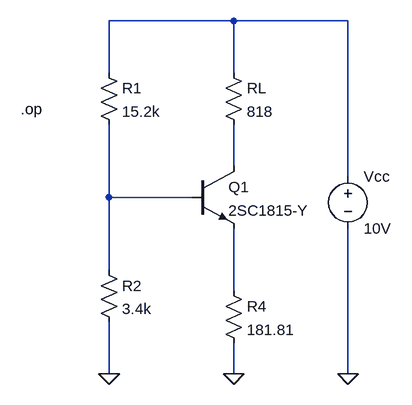
[diagram p0: schematic jikken2_denryukikan_DC.asc]
jikken2_denryukikan_DC.asc, the LTspice schematic file:
Version 4
SHEET 1 968 680
WIRE 256 -112 64 -112
WIRE 432 -112 256 -112
WIRE 64 -32 64 -112
WIRE 256 -32 256 -112
WIRE 256 112 256 48
WIRE 432 128 432 -112
WIRE 64 160 64 48
WIRE 192 160 64 160
WIRE 64 272 64 160
WIRE 256 304 256 208
WIRE 64 432 64 352
WIRE 256 432 256 384
WIRE 432 432 432 208
FLAG 64 432 0
FLAG 256 432 0
FLAG 432 432 0
DATAFLAG 256 -48 "I(Rl)"
DATAFLAG 64 272 "I(R2)"
DATAFLAG 256 288 "Ie(Q1)"
DATAFLAG 64 80 "I(R1)"
DATAFLAG 160 160 "Ib(Q1)"
SYMBOL npn 192 112 R0
SYMATTR InstName Q1
SYMATTR Value 2SC1815-Y
SYMBOL res 48 -48 R0
SYMATTR InstName R1
SYMATTR Value 15.2k
SYMBOL res 48 256 R0
SYMATTR InstName R2
SYMATTR Value 3.4k
SYMBOL res 240 -48 R0
SYMATTR InstName RL
SYMATTR Value 818
SYMBOL res 240 288 R0
SYMATTR InstName R4
SYMATTR Value 181.81
SYMBOL voltage 432 112 R0
SYMATTR InstName Vcc
SYMATTR Value 10V
TEXT -72 24 Left 2 !.op

The netlist it stands for:
* jikken2_denryukikan_DC.asc
Q1 N002 N003 N004 0 2SC1815-Y
R1 N001 N003 15.2k
R2 N003 0 3.4k
RL N001 N002 818
R4 N004 0 181.81
Vcc N001 0 10V
.model NPN NPN
.model PNP PNP
.lib standard.bjt
.op
.backanno
.end